# EasyEDA Pro project ProPrj_NFC1_2025-03-09.epro

# Board 电机驱动ASCII8833-3
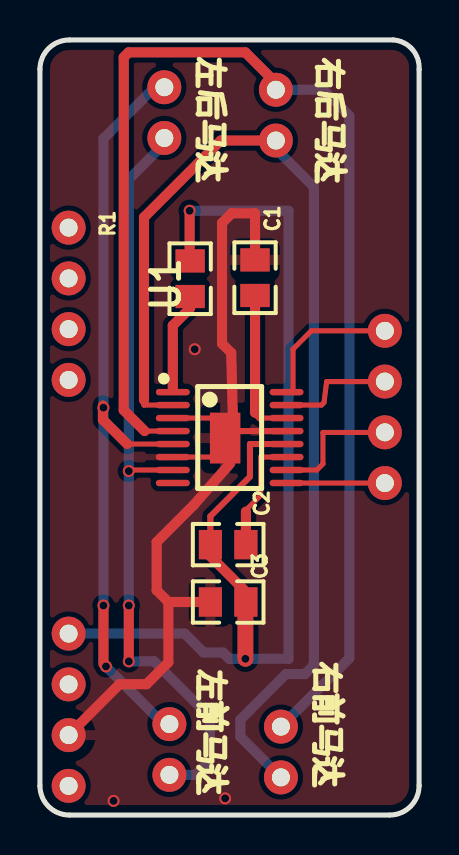
[diagram p0: board, top side]
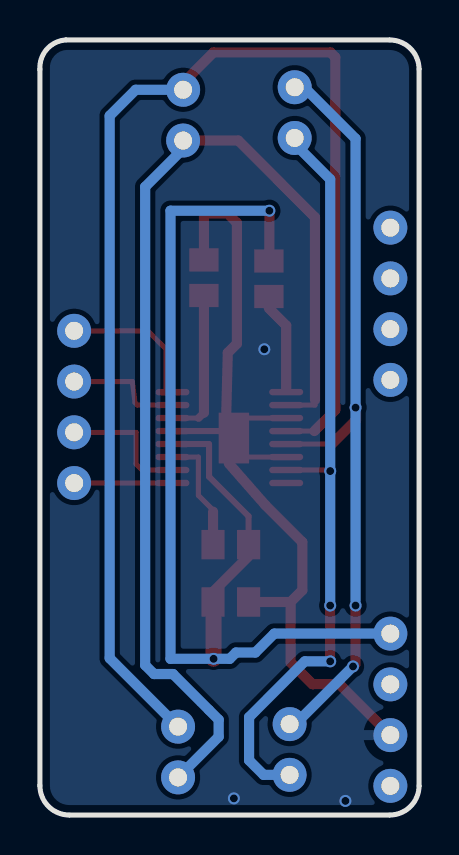
[diagram p1: board, bottom side, seen from below]

Outline 19 x 38.8 mm; copper layers: Top Layer, Bottom Layer. Coordinates in mm from the lower left corner of the outline.
Outline path: 0,37.32 arc(0.43,38.36) 1.47,38.8 ; 0,37.32 arc(0.43,38.36) 1.47,38.8 ; 0,37.32 0,1.47 ; 0,37.32 0,1.47 ; 1.47,38.8 17.7,38.8 ; 1.47,38.8 17.7,38.8 ; 0,1.47 arc(0.43,0.43) 1.47,0 ; 0,1.47 arc(0.43,0.43) 1.47,0 ; 17.7,38.8 arc(18.65,38.33) 19,37.32 ; 17.7,38.8 arc(18.65,38.33) 19,37.32 ; 1.47,0 17.53,0 ; 1.47,0 17.53,0 ; 17.53,0 arc(18.57,0.43) 19,1.47 ; 17.53,0 arc(18.57,0.43) 19,1.47 ; 19,37.32 19,1.47 ; 19,37.32 19,1.47
Stack: Top Layer 0.0356mm / Dielectric1 0.32mm FR-4 er 4.8 / Bottom Layer 0.0356mm

## Design rules (mm)
spacing Clearance (default): track to track 0.254, other pairs 0 to 0.254
track width Width (default): min 0.254, default 0.508, max 1.27
differential pair DiffPairsRouting (default): width min 0.381, default 0.381, max 0.381; gap min 0.254, default 0.254
via RoutingVias (default): diameter min 1.27, default 1.27, max 1.27; hole min 0.711, default 0.711, max 0.711

## Placement (name value [footprint] x y rotation side)
C1  2.2UF  [0805_R]  10.78 26.89 270 top
C2  10NF  [0805_R]  9.43 13.53 0 top
C3  10NF  [0805_R]  9.43 10.66 0 top
NOREF  -  [Pad_ie9]  6.23 33.89 270 top
NOREF#2  -  [Pad_ie10]  6.23 36.43 270 top
NOREF#3  -  [Pad_ie16]  1.44 4 270 top
NOREF#4  -  [Pad_ie7]  11.82 33.76 270 top
NOREF#5  -  [Pad_ie18]  1.44 9.08 270 top
NOREF#6  -  [Pad_ie189]  1.44 26.86 270 top
NOREF#7  -  [Pad_ie190]  1.44 29.4 270 top
NOREF#8  -  [Pad_ie17]  1.44 6.54 270 top
NOREF#9  -  [Pad_ie13]  17.28 19.16 270 top
NOREF#10  -  [Pad_ie14]  17.28 16.62 270 top
NOREF#11  -  [Pad_ie15]  1.44 1.46 270 top
NOREF#12  -  [Pad_ie4]  6.49 2.01 270 top
NOREF#13  -  [Pad_ie2]  1.44 24.32 270 top
NOREF#14  -  [Pad_ie5]  12.07 4.42 270 top
NOREF#15  -  [Pad_ie8]  11.82 36.3 270 top
NOREF#16  -  [Pad_ie11]  17.28 24.24 270 top
NOREF#17  -  [Pad_ie12]  17.28 21.7 270 top
NOREF#18  -  [Pad_ie3]  6.49 4.55 270 top
NOREF#19  -  [Pad_ie1]  1.44 21.78 270 top
NOREF#20  -  [Pad_ie21]  9.28 18.87 0 top
NOREF#21  -  [Pad_ie6]  12.07 1.88 270 top
R1  47K  [0805_R]  7.53 26.84 270 top
U1  DRV8833  [TSSOP-16]  9.51 18.89 270 top

## Footprints (pads in the part's own frame, mm; a bottom-side part is the same pattern mirrored in y, then rotated)
0805_R
  rect 1.16x1.47 smd: 1(-0.89,0) 2(0.89,0)
Pad_ie1
  round 1.7 hole 0.9: 0(0,0)
Pad_ie2
  round 1.7 hole 0.9: 0(0,0)
Pad_ie3
  round 1.7 hole 0.9: 0(0,0)
Pad_ie4
  round 1.7 hole 0.9: 0(0,0)
Pad_ie5
  round 1.7 hole 0.9: 0(0,0)
Pad_ie6
  round 1.7 hole 0.9: 0(0,0)
Pad_ie7
  round 1.7 hole 0.9: 0(0,0)
Pad_ie8
  round 1.7 hole 0.9: 0(0,0)
Pad_ie9
  round 1.7 hole 0.9: 0(0,0)
Pad_ie10
  round 1.7 hole 0.9: 0(0,0)
Pad_ie11
  round 1.7 hole 0.9: 0(0,0)
Pad_ie12
  round 1.7 hole 0.9: 0(0,0)
Pad_ie13
  round 1.7 hole 0.9: 0(0,0)
Pad_ie14
  round 1.7 hole 0.9: 0(0,0)
Pad_ie15
  round 1.7 hole 0.9: 0(0,0)
Pad_ie16
  round 1.7 hole 0.9: 0(0,0)
Pad_ie17
  round 1.7 hole 0.9: 0(0,0)
Pad_ie18
  round 1.7 hole 0.9: 0(0,0)
Pad_ie21
  rect 1.524x2.54 smd: 1(0,0)
Pad_ie189
  round 1.7 hole 0.9: 0(0,0)
Pad_ie190
  round 1.7 hole 0.9: 0(0,0)
TSSOP-16
  oval 0.32x1.7 smd: 1(-2.275,-2.85) 2(-1.625,-2.85) 3(-0.975,-2.85) 4(-0.325,-2.85) 5(0.325,-2.85) 6(0.975,-2.85) 7(1.625,-2.85) 8(2.275,-2.85) 9(2.275,2.85) 10(1.625,2.85) 11(0.975,2.85) 12(0.325,2.85) 13(-0.325,2.85) 14(-0.975,2.85) 15(-1.625,2.85) 16(-2.275,2.85)

## Nets
GND: C1.1 C3.1 NOREF#3.0 NOREF#20.1 U1.3 U1.6 U1.13
VCC: C2.1 C3.2 NOREF#5.0 R1.1 U1.12

Pads without a net: C1 2; C2 2; NOREF 0; NOREF#2 0; NOREF#4 0; NOREF#6 0; NOREF#7 0; NOREF#8 0; NOREF#9 0; NOREF#10 0; NOREF#11 0; NOREF#12 0; NOREF#13 0; NOREF#14 0; NOREF#15 0; NOREF#16 0; NOREF#17 0; NOREF#18 0; NOREF#19 0; NOREF#21 0; R1 2; U1 1 2 4 5 7 8 9 10 11 14 15 16

## Via types
v1: diameter 0.6, hole 0.4, Top Layer to Bottom Layer, 11 vias

## Routing (per net, layer and track width the routed paths; a pad name or vN(x,y) marks a point on that pad's centre or on a via; arc(x,y) is an arc through that point)
GND: length 40.9
  Top Layer w0.254: U1.3 8.77,19.87 ; U1.6 8.77,17.92
  Top Layer w0.305: 9.79,19.22 U1.13
  Top Layer w0.508: 6.43,10.66 C3.1 ; 6.43,10.66 5.85,11.25 5.85,13.66 7.7,15.52 9.53,17.6 ; 6.43,10.66 6.43,7.64 5.34,6.55 3.99,6.55 NOREF#3.0 ; 9.66,20.14 9.58,23.14 9.13,23.59 9.13,29.64 9.61,30.12 10.78,30.12 C1.1
  vias: v1(3.69,0.71) v1(7.75,23.31) v1(9.28,0.83)
VCC: length 53.4
  Top Layer w0.305: C2.1 8.54,14.96 10.52,16.94 10.52,18.57 11.69,18.57
  Top Layer w0.508: 8.54,12.95 10.32,11.17 ; 7.5,27.68 v1(7.5,30.25)
  Top Layer w0.8: v1(10.29,7.82) 10.29,10.23
  Bottom Layer w0.508: v1(7.5,30.25) 12.45,30.25 12.45,7.82 v1(10.29,7.82) 9.49,7.82 9.17,8.14 8.2,8.14 7.26,9.08 NOREF#5.0
(no net): length 242.8
  Top Layer w0.254: U1.15 14.11,20.52 14.23,20.65 14.37,21.7 NOREF#17.0 16.95,21.36 16.61,21.7 ; 5.21,20.77 5.21,20.52 U1.2 ; NOREF#16.0 13.6,24.24 12.68,23.32 12.68,21.13 ; 5.25,19.22 U1.4 ; 17.28,19.15 14.18,19.15 14.18,17.57 13.88,17.27 U1.10 ; 16.77,18.63 17.1,18.63 ; 4.45,17.27 U1.7 ; 4.37,18.57 U1.5 ; 11.05,19.87 U1.14 ; 7.53,25.37 R1.2 ; 12.64,16.62 NOREF#10.0 ; 10.4,15.34 11.06,16 11.06,17.92 U1.11
  Top Layer w0.381: 10.78,20.14 11.05,19.87
  Top Layer w0.508: 6.66,21.28 6.66,24.5 7.53,25.37 ; C2.2 10.32,15.19 ; 5.21,20.77 5.21,29.92 9.06,33.76 NOREF#4.0 ; 3.18,7.57 v1(3.18,10.49) ; 4.37,18.57 3.16,19.78 3.16,20.49 ; 11.82,36.27 NOREF#15.0 11.82,36.65 10.29,38.17 4.44,38.17 4.2,37.93 4.2,20.27 5.25,19.22 ; 10.78,20.14 C1.2 ; v1(4.45,7.69) v1(4.45,10.49)
  Bottom Layer w0.254: 17.39,16.46 17.43,16.46 17.6,16.45 17.76,16.43 17.93,16.4
  Bottom Layer w0.508: NOREF#15.0 14.2,36.3 15.5,35 15.5,7.85 NOREF#14.0 ; NOREF#2.0 5.76,36.43 3.18,33.85 3.18,10.74 ; v1(3.31,7.44) 6.2,4.55 NOREF#18.0 ; NOREF#21.0 10.04,3.92 10.04,4.77 12.33,7.06 13.28,7.06 13.72,7.5 13.72,31.44 11.82,33.34 NOREF#4.0 ; v1(4.45,10.49) 4.45,31.82 6.23,33.6 NOREF.0 ; NOREF#12.0 7.79,2.01 8.52,2.74 8.52,4.9 5.72,7.69 v1(4.45,7.69)
  vias: v1(3.18,20.39) v1(4.45,17.22)

## Copper pours and planes (outline as drawn; the poured copper is in the pictures)
GND on Top Layer: -1.14,39.82 19.95,39.82 19.95,-1.32 -1.14,-1.32
GND on Bottom Layer: -0.5,39.19 19.57,39.19 19.57,-0.94 -0.5,-0.94

## Text on the board
Top Silkscreen Layer: 左后马达 | 左前马达 | 右前马达 | 右后马达

# Board 麦克轮驱动
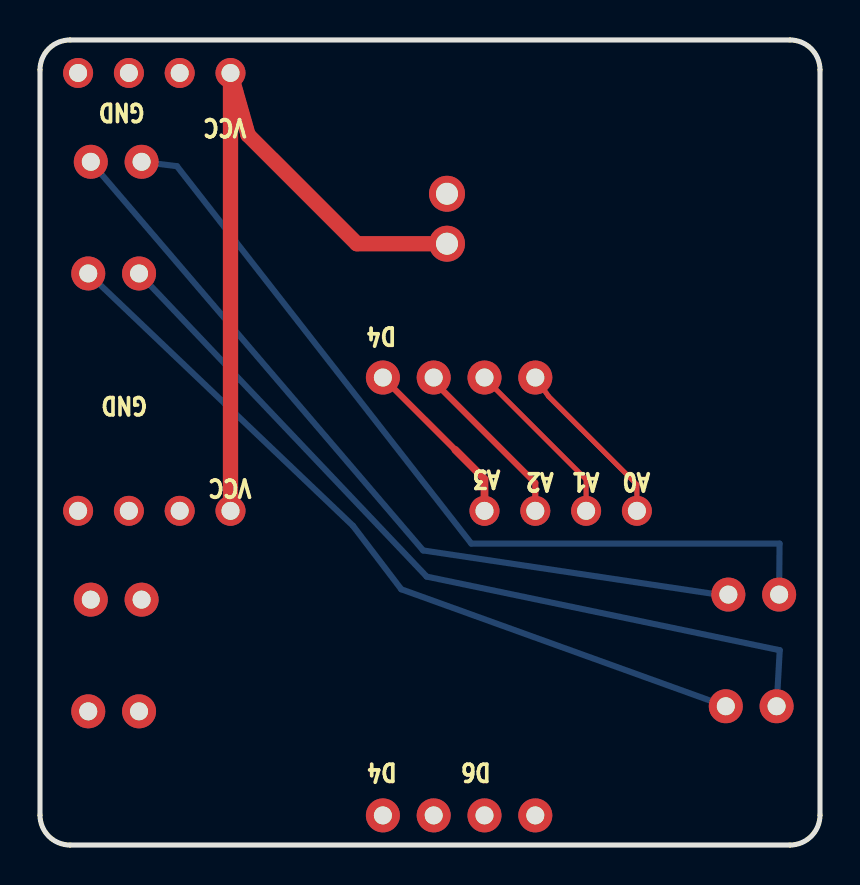
[diagram p2: board, top side]
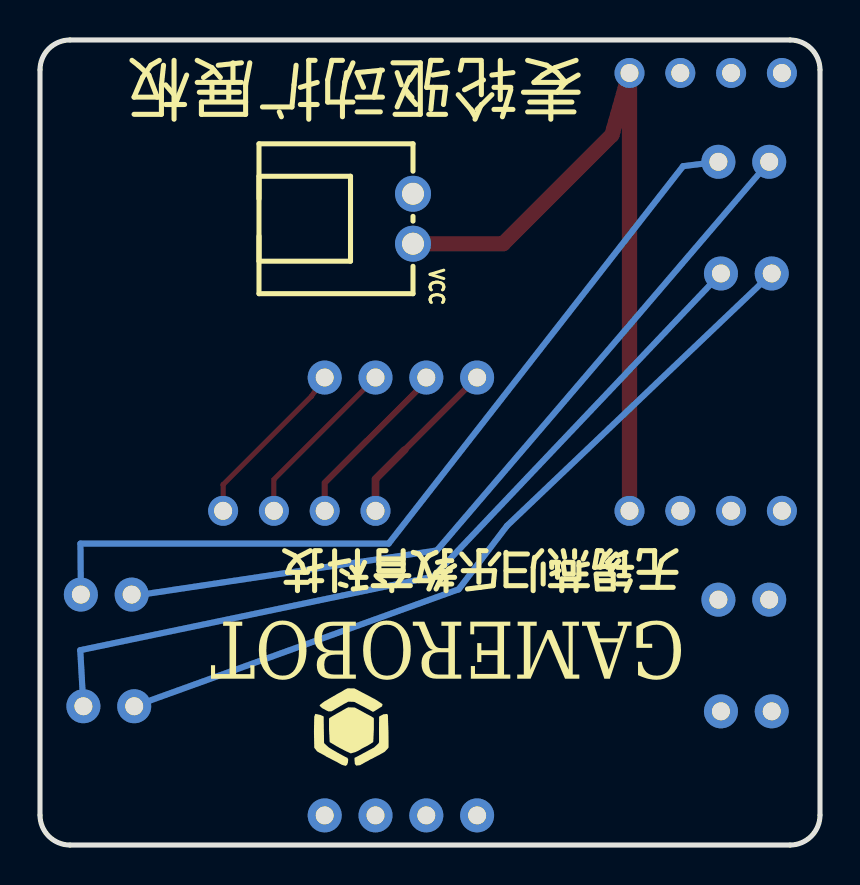
[diagram p3: board, bottom side, seen from below]

Outline 39 x 40.28 mm; copper layers: Top Layer, Bottom Layer. Coordinates in mm from the lower left corner of the outline.
Outline path: 0,38.78 0,1.5 arc(0.44,0.44) 1.5,0 37.5,0 arc(38.56,0.44) 39,1.5 39,38.78 arc(38.56,39.85) 37.5,40.28 1.5,40.28 arc(0.44,39.85) 0,38.78
Stack: Top Layer 0.035mm / Dielectric1 1.51mm FR4 er 4.5 / Bottom Layer 0.035mm

## Design rules (mm)
template: JLCPCB Capability(Two Layers Board)
spacing copperThickness1oz (default): track to track 0.102, other pairs 0.152 to 0.3
spacing copperThickness2oz: track to track 0.203, other pairs 0.152 to 0.3
track width copperThickness1oz (default): min 0.127, default 0.254, max 2.54
track width copperThickness2oz: min 0.203, default 0.254, max 2.54
differential pair differentialPair (default): width min 0.127, default 0.254, max 2.54; gap min 0.152, default 0.152
via viaSize (default): diameter min 0.5, default 0.61, max 10; hole min 0.3, default 0.305, max 6.3

## Placement (name value [footprint] x y rotation side)
NOREF  -  [Pad_ie10]  5.08 12.28 180 top
NOREF#2  -  [Pad_ie20]  4.95 28.6 180 top
NOREF#3  -  [Pad_e15]  24.77 16.72 0 top
NOREF#4  -  [Pad_ie17]  22.23 23.39 180 top
NOREF#5  -  [Pad_ie7]  17.15 1.48 180 top
NOREF#6  -  [Pad_ie4]  24.77 1.48 180 top
NOREF#7  -  [Pad_ie16]  24.77 23.39 180 top
NOREF#8  -  [Pad_ie9]  2.41 6.69 180 top
NOREF#9  -  [Pad_e360]  9.53 38.63 0 top
NOREF#10  -  [Pad_ie11]  2.54 12.28 180 top
NOREF#11  -  [Pad_ie21]  2.41 28.6 180 top
NOREF#12  -  [Pad_ie3]  34.29 6.94 180 top
NOREF#13  -  [Pad_e14]  22.23 16.72 0 top
NOREF#14  -  [Pad_e11]  9.53 16.72 0 top
NOREF#15  -  [Pad_ie0]  36.96 12.53 180 top
NOREF#16  -  [Pad_e16]  27.31 16.72 0 top
NOREF#17  -  [Pad_e357]  1.91 38.63 0 top
NOREF#18  -  [Pad_ie19]  17.15 23.39 180 top
NOREF#19  -  [Pad_ie2]  36.83 6.94 180 top
NOREF#20  -  [Pad_ie8]  4.95 6.69 180 top
NOREF#21  -  [Pad_e10]  6.99 16.72 0 top
NOREF#22  -  [Pad_e358]  4.45 38.63 0 top
NOREF#23  -  [Pad_e8]  1.91 16.72 0 top
NOREF#24  -  [Pad_e359]  6.99 38.63 0 top
NOREF#25  -  [Pad_ie18]  19.69 23.39 180 top
NOREF#26  -  [Pad_e9]  4.45 16.72 0 top
NOREF#27  -  [Pad_ie23]  2.54 34.19 180 top
NOREF#28  -  [Pad_ie22]  5.08 34.19 180 top
NOREF#29  -  [Pad_ie6]  19.69 1.48 180 top
NOREF#30  -  [Pad_e17]  29.84 16.72 0 top
NOREF#31  -  [Pad_ie1]  34.42 12.53 180 top
NOREF#32  -  [Pad_ie5]  22.23 1.48 180 top
VCC  HX25003-2WAP  [CONN-TH_2P-P2.50_HX25003-2WAP]  20.35 31.34 270 bottom

## Footprints (pads in the part's own frame, mm; a bottom-side part is the same pattern mirrored in y, then rotated)
CONN-TH_2P-P2.50_HX25003-2WAP
  round 1.8 hole 1.1: 1(-1.25,0) 2(1.25,0)
Pad_e8
  round 1.5 hole 0.9: 7(0,0)
Pad_e9
  round 1.5 hole 0.9: 8(0,0)
Pad_e10
  round 1.5 hole 0.9: 9(0,0)
Pad_e11
  round 1.5 hole 0.9: 10(0,0)
Pad_e14
  round 1.5 hole 0.9: 9(0,0)
Pad_e15
  round 1.5 hole 0.9: 9(0,0)
Pad_e16
  round 1.5 hole 0.9: 9(0,0)
Pad_e17
  round 1.5 hole 0.9: 9(0,0)
Pad_e357
  round 1.5 hole 0.9: 7(0,0)
Pad_e358
  round 1.5 hole 0.9: 8(0,0)
Pad_e359
  round 1.5 hole 0.9: 9(0,0)
Pad_e360
  round 1.5 hole 0.9: 10(0,0)
Pad_ie0
  round 1.7 hole 0.9: 0(0,0)
Pad_ie1
  round 1.7 hole 0.9: 0(0,0)
Pad_ie2
  round 1.7 hole 0.9: 0(0,0)
Pad_ie3
  round 1.7 hole 0.9: 0(0,0)
Pad_ie4
  round 1.7 hole 0.9: 0(0,0)
Pad_ie5
  round 1.7 hole 0.9: 0(0,0)
Pad_ie6
  round 1.7 hole 0.9: 0(0,0)
Pad_ie7
  round 1.7 hole 0.9: 0(0,0)
Pad_ie8
  round 1.7 hole 0.9: 0(0,0)
Pad_ie9
  round 1.7 hole 0.9: 0(0,0)
Pad_ie10
  round 1.7 hole 0.9: 0(0,0)
Pad_ie11
  round 1.7 hole 0.9: 0(0,0)
Pad_ie16
  round 1.7 hole 0.9: 0(0,0)
Pad_ie17
  round 1.7 hole 0.9: 0(0,0)
Pad_ie18
  round 1.7 hole 0.9: 0(0,0)
Pad_ie19
  round 1.7 hole 0.9: 0(0,0)
Pad_ie20
  round 1.7 hole 0.9: 0(0,0)
Pad_ie21
  round 1.7 hole 0.9: 0(0,0)
Pad_ie22
  round 1.7 hole 0.9: 0(0,0)
Pad_ie23
  round 1.7 hole 0.9: 0(0,0)

## Nets
GND: NOREF#22.8 NOREF#26.8 VCC.1
VCC: NOREF#9.10 NOREF#14.10 VCC.2
5: NOREF#5.0
6: NOREF#29.0
7: NOREF#32.0
8: NOREF#6.0
A0: NOREF#7.0 NOREF#30.9
A1: NOREF#4.0 NOREF#16.9
A2: NOREF#3.9 NOREF#25.0
A3: NOREF#13.9 NOREF#18.0

Pads without a net: NOREF 0; NOREF#2 0; NOREF#8 0; NOREF#10 0; NOREF#11 0; NOREF#12 0; NOREF#15 0; NOREF#17 7; NOREF#19 0; NOREF#20 0; NOREF#21 9; NOREF#23 7; NOREF#24 9; NOREF#27 0; NOREF#28 0; NOREF#31 0

## Routing (per net, layer and track width the routed paths; a pad name or vN(x,y) marks a point on that pad's centre or on a via; arc(x,y) is an arc through that point)
VCC: length 37.3
  Top Layer w0.762: VCC.2 15.84,30.09 10.41,35.53 NOREF#9.10 NOREF#14.10
(no net): length 166
  Bottom Layer w0.305: NOREF#28.0 6.85,33.97 21.57,15.08 36.98,15.08 NOREF#15.0 ; NOREF#11.0 15.65,15.97 18.06,12.8 NOREF#12.0 ; NOREF#19.0 36.99,9.75 19.33,13.43 NOREF#2.0 ; NOREF#27.0 19.16,14.74 34.33,12.47 NOREF#31.0
A0: length 8.7
  Top Layer w0.254: NOREF#7.0 25.43,22.45 29.84,18.03 NOREF#30.9
A1: length 8.8
  Top Layer w0.254: NOREF#4.0 22.23,23.37 27.31,18.29 NOREF#16.9
A2: length 8.8
  Top Layer w0.305: NOREF#3.9 24.77,18.12 19.69,23.2 NOREF#25.0
A3: length 8.8
  Top Layer w0.305: 20.77,19.77 NOREF#18.0
  Top Layer w0.381: 20.77,19.77 22.23,18.31 NOREF#13.9

## Copper pours and planes (outline as drawn; the poured copper is in the pictures)
GND on Top Layer: -0.73,40.99 40.04,40.99 40.04,-0.79 -0.73,-0.79
GND on Bottom Layer: -0.86,41.5 39.65,41.5 39.65,-0.54 -0.86,-0.54

## Text on the board
Bottom Silkscreen Layer: 无锡燕归乐教育科技 | 麦轮驱动扩展板 | GAMEROBOT
Top Silkscreen Layer: GND | VCC | D4 | D6 | A3 | A2 | A1 | A0

# Board NFC1扩展板
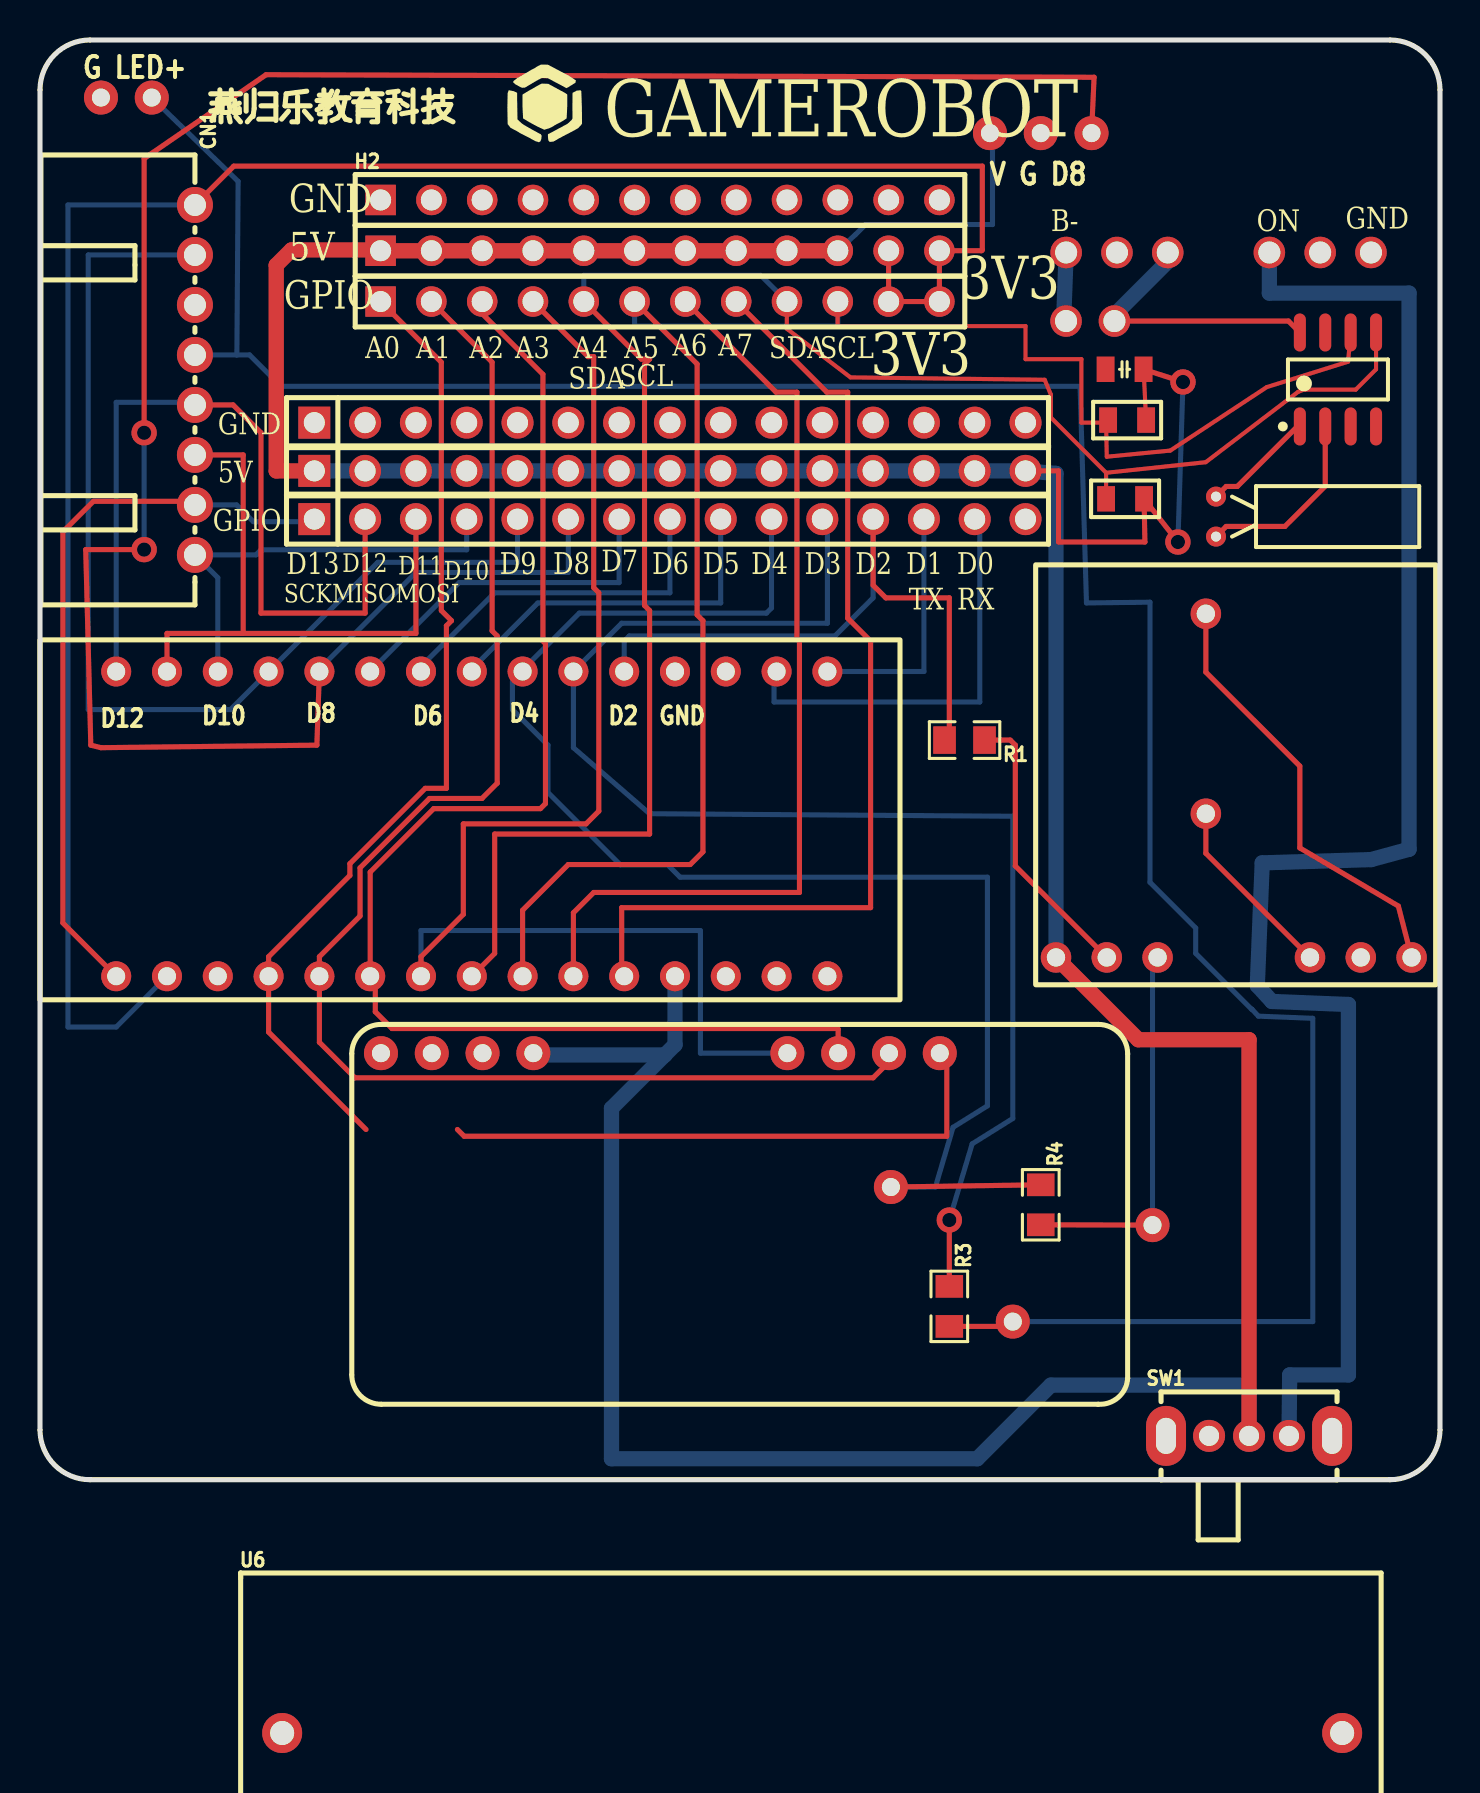
[diagram p4: board, top side]
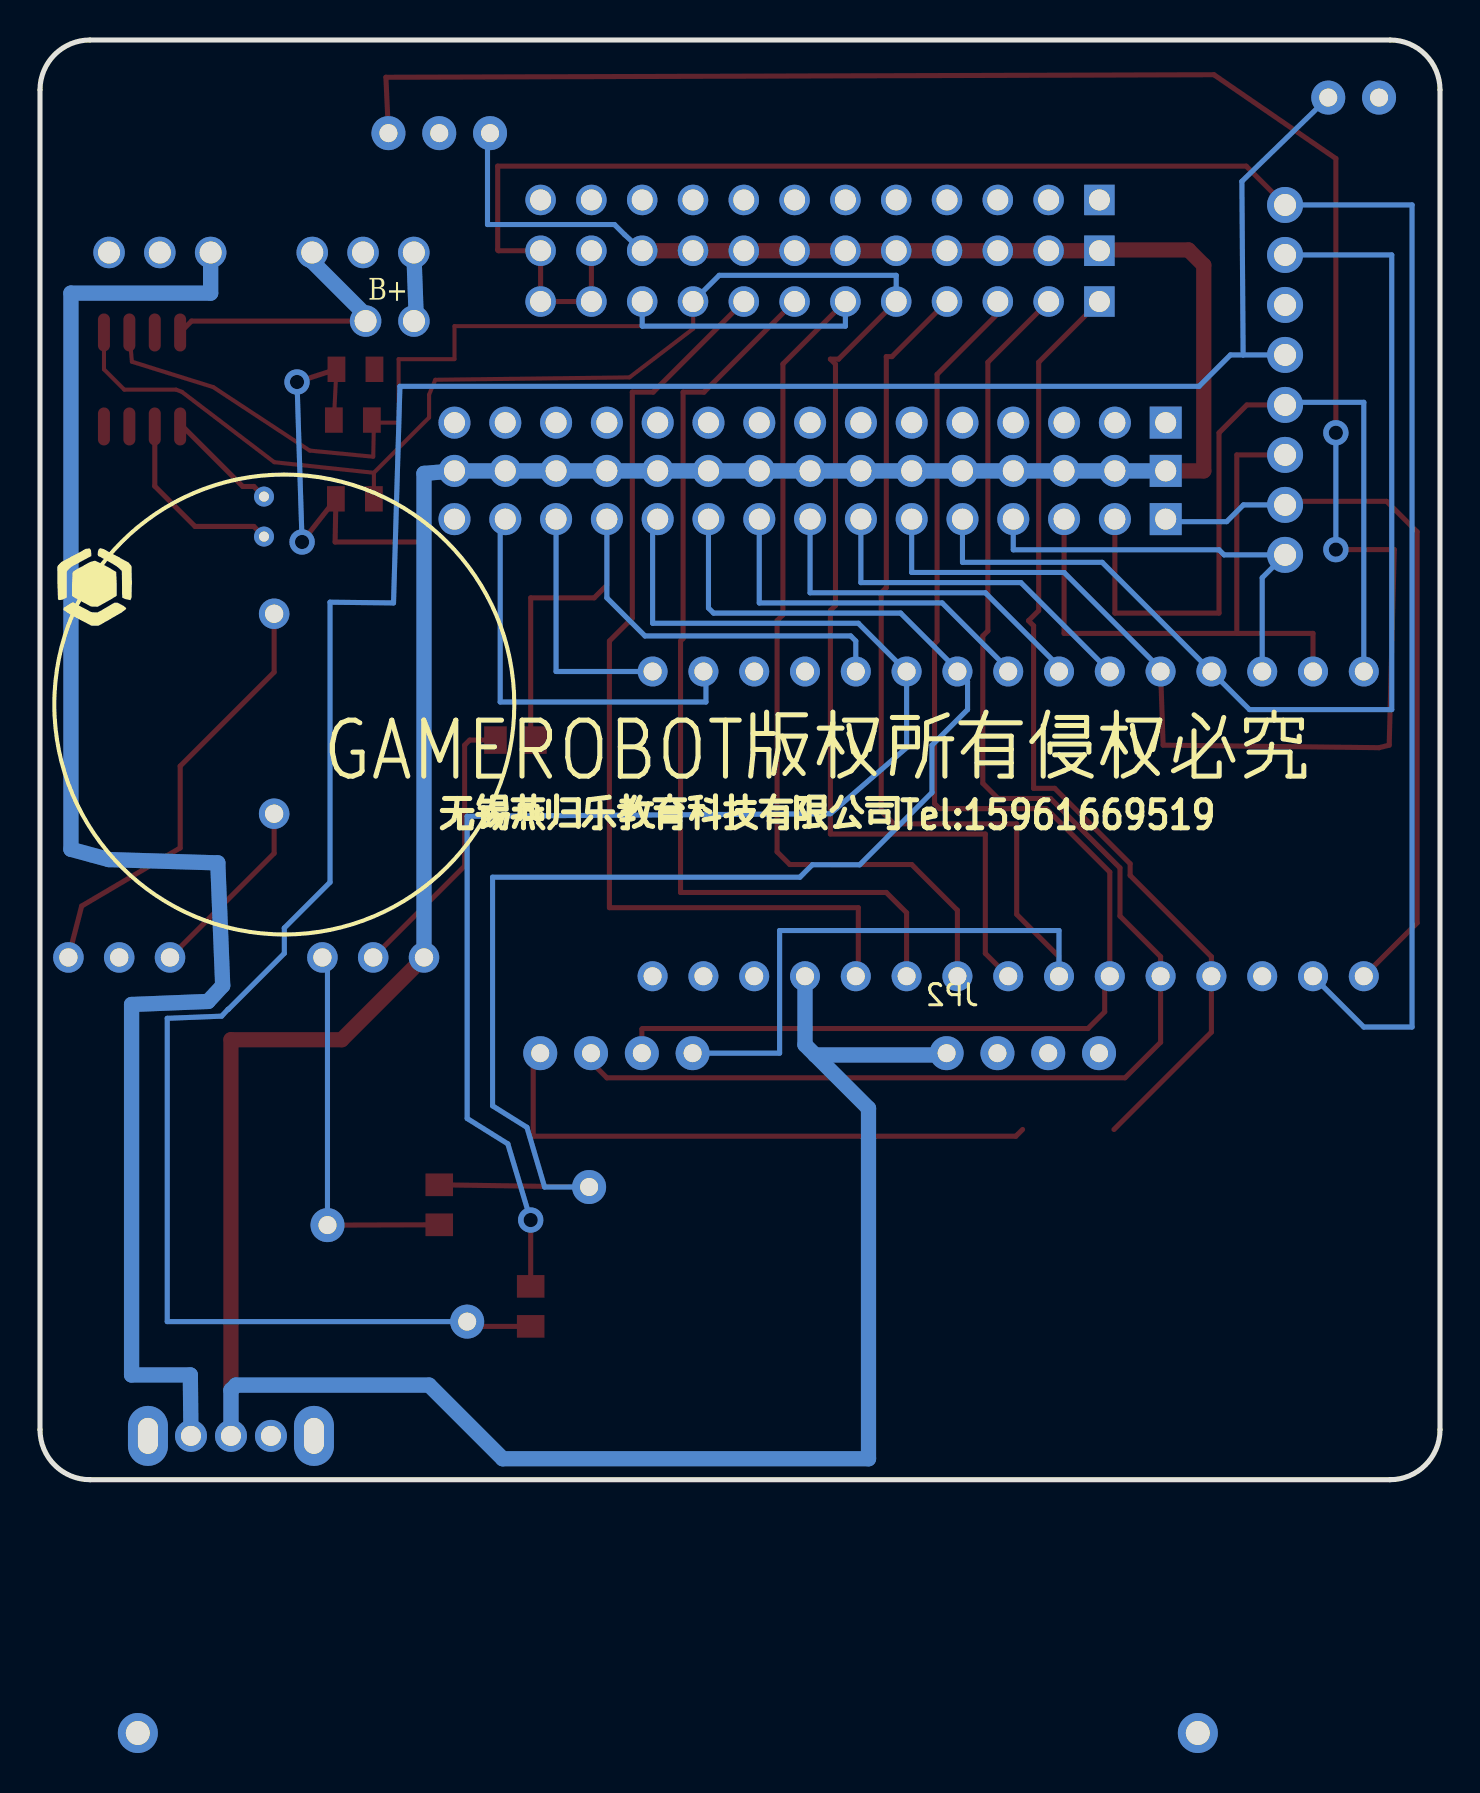
[diagram p5: board, bottom side, seen from below]

Outline 70 x 72 mm; copper layers: Top Layer, Bottom Layer. Coordinates in mm from the lower left corner of the outline.
Outline path: 0,69.5 0,2.5 arc(0.73,0.73) 2.5,0 67.5,0 arc(69.27,0.73) 70,2.5 70,69.5 arc(69.27,71.27) 67.5,72 2.5,72 arc(0.73,71.27) 0,69.5
Stack: Top Layer 0.0356mm / Dielectric1 0.32mm FR-4 er 4.8 / Bottom Layer 0.0356mm

## Design rules (mm)
template: 用户自定义配置
spacing Clearance (default): track to track 0.254, other pairs 0 to 0.254
track width Width (default): min 0.203, default 0.254, max 0.762
differential pair DiffPairsRouting (default): width min 0.381, default 0.381, max 0.381; gap min 0.254, default 0.254
via RoutingVias (default): diameter min 1.27, default 1.27, max 1.27; hole min 0.711, default 0.711, max 0.711

## Placement (name value [footprint] x y rotation side)
C20  104  [C 0805_L]  54.23 55.53 180 top
CN1  HX25003-8WAP  [CONN-TH_8P-P2.50_HX25003-8WAP]  7.75 55 270 top
H2  -  [HDR-TH_15P-P2.54-V-M]  31.5 52.86 0 top
H2#2  -  [HDR-TH_15P-P2.54-V-M]  31.5 50.45 0 top
H2#3  -  [HDR-TH_15P-P2.54-V-M]  31.5 48.04 0 top
H2#4  -  [HDR-TH_12P-P2.54-V-M]  31 64 0 top
H3  -  [HDR-TH_12P-P2.54-V-M]  31 61.46 0 top
H4  -  [HDR-TH_12P-P2.54-V-M]  31 58.92 0 top
JP2  Header-Male-2.54_1x15  [hdr-th_15p-p2.54-v-a]  21.59 25.18 180 top
JP3  Header-Male-2.54_1x15  [hdr-th_15p-p2.54-v-a]  21.59 40.42 180 top
NOREF  -  [Pad_e1]  47.5 67.34 0 top
NOREF#2  -  [Pad_e81]  53.72 57.94 0 top
NOREF#3  -  [Pad_ie25]  66.04 26.12 0 top
NOREF#4  -  [Pad_e804]  64.01 61.37 0 top
NOREF#5  -  [Pad_ie46]  24.67 21.33 180 top
NOREF#6  -  [Pad_e82]  51.3 57.94 0 top
NOREF#7  -  [Pad_ie15]  53.34 26.12 0 top
NOREF#8  -  [Pad_e12]  52.58 67.34 0 top
NOREF#9  -  [Pad_e811]  53.85 61.37 0 top
NOREF#10  -  [Pad_e6]  42.45 21.33 0 top
NOREF#11  -  [Pad_e423]  5.59 69.12 180 top
NOREF#12  -  [Pad_ie45]  42.54 14.64 180 top
NOREF#13  -  [Pad_e76]  51.31 61.37 0 top
NOREF#14  -  [Pad_ie47]  22.13 21.33 180 top
NOREF#15  -  [Pad_ie20]  63.5 26.12 0 top
NOREF#16  -  [Pad_e749]  48.64 7.91 180 top
NOREF#17  -  [Pad_e230]  58.29 43.31 270 top
NOREF#18  -  [Pad_ie12]  50.8 26.12 0 top
NOREF#19  -  [Pad_e67]  66.55 61.37 0 top
NOREF#20  -  [Pad_ie48]  19.59 21.33 180 top
NOREF#21  -  [Pad_ie16]  55.88 26.12 0 top
NOREF#22  -  [Pad_ie26]  68.58 26.12 0 top
NOREF#23  -  [Pad_e9]  50.04 67.34 0 top
NOREF#24  -  [Pad_e232]  58.29 33.31 270 top
NOREF#25  -  [Pad_e8]  37.37 21.33 0 top
NOREF#26  -  [Pad_e5]  44.99 21.33 0 top
NOREF#27  -  [Pad_e73]  61.47 61.37 0 top
NOREF#28  -  [Pad_e23]  55.63 12.73 0 top
NOREF#29  -  [Pad_ie49]  17.05 21.33 180 top
NOREF#30  -  [Pad_e425]  3.05 69.12 180 top
NOREF#31  -  [Pad_e75]  56.39 61.37 0 top
NOREF#32  -  [Pad_e7]  39.91 21.33 0 top
R1  10K  [R0805]  46.23 36.99 180 top
R3  1K  [R0805]  45.47 8.67 270 top
R4  1K  [R0805]  50.04 13.75 270 top
R16  10K  [R 0805_L]  54.36 52.99 0 top
R17  10K  [R 0805_L]  54.25 49.05 0 top
SW1  -  [拨动开关_侧]  60.45 2.19 0 top
U5  DS1307Z+T&R  [S8+2_L]  64.9 55.02 90 top
U6  1节5号电池座带焊针  [BAT-TH_L57.0-W16.0-P53.00]  38.61 -12.67 0 top
Y3  32.768kHz  [OSC-3x8-WI-A]  58.8 48.17 270 top

## Footprints (pads in the part's own frame, mm; a bottom-side part is the same pattern mirrored in y, then rotated)
BAT-TH_L57.0-W16.0-P53.00
  round 2 hole 1.2: 1(-26.5,0) 2(26.5,0)
C 0805_L
  rect 0.889x1.27 smd: 1(-0.95,0) 2(0.95,0)
CONN-TH_8P-P2.50_HX25003-8WAP
  round 1.8 hole 1.1: 1(-8.75,0) 2(-6.25,0) 3(-3.75,0) 4(-1.25,0) 5(1.25,0) 6(3.75,0) 7(6.25,0) 8(8.75,0)
HDR-TH_12P-P2.54-V-M
  rect 1.524x1.524 hole 1.05: 1(-13.97,0)
  round 1.524 hole 1.05: 2(-11.43,0) 3(-8.89,0) 4(-6.35,0) 5(-3.81,0) 6(-1.27,0) 7(1.27,0) 8(3.81,0) 9(6.35,0) 10(8.89,0) 11(11.43,0) 12(13.97,0)
hdr-th_15p-p2.54-v-a
  round 1.5 hole 0.9: 1(-17.78,0) 2(-15.24,0) 3(-12.7,0) 4(-10.16,0) 5(-7.62,0) 6(-5.08,0) 7(-2.54,0) 8(0,0) 9(2.54,0) 10(5.08,0) 11(7.62,0) 12(10.16,0) 13(12.7,0) 14(15.24,0) 15(17.78,0)
HDR-TH_15P-P2.54-V-M
  rect 1.6x1.6 hole 1.05: 1(-17.78,0)
  round 1.6 hole 1.05: 2(-15.24,0) 3(-12.7,0) 4(-10.16,0) 5(-7.62,0) 6(-5.08,0) 7(-2.54,0) 8(0,0) 9(2.54,0) 10(5.08,0) 11(7.62,0) 12(10.16,0) 13(12.7,0) 14(15.24,0) 15(17.78,0)
OSC-3x8-WI-A
  round 1 hole 0.5: 1(1,0) 2(-1,0)
Pad_e1
  round 1.7 hole 0.9: 21(0,0)
Pad_e5
  round 1.7 hole 0.9: 1(0,0)
Pad_e6
  round 1.7 hole 0.9: 2(0,0)
Pad_e7
  round 1.7 hole 0.9: 3(0,0)
Pad_e8
  round 1.7 hole 0.9: 4(0,0)
Pad_e9
  round 1.7 hole 0.9: 22(0,0)
Pad_e12
  round 1.7 hole 0.9: 23(0,0)
Pad_e23
  round 1.7 hole 0.9: 10(0,0)
Pad_e67
  round 1.575 hole 1.1: 1(0,0)
Pad_e73
  round 1.575 hole 1.1: 3(0,0)
Pad_e75
  round 1.575 hole 1.1: 3(0,0)
Pad_e76
  round 1.575 hole 1.1: 3(0,0)
Pad_e81
  round 1.575 hole 1.1: 3(0,0)
Pad_e82
  round 1.575 hole 1.1: 3(0,0)
Pad_e230
  round 1.524 hole 0.914: 2(0,0)
Pad_e232
  round 1.524 hole 0.914: 1(0,0)
Pad_e423
  round 1.7 hole 0.9: 21(0,0)
Pad_e425
  round 1.7 hole 0.9: 21(0,0)
Pad_e749
  round 1.7 hole 0.9: 1(0,0)
Pad_e804
  round 1.575 hole 1.1: 3(0,0)
Pad_e811
  round 1.575 hole 1.1: 3(0,0)
Pad_ie12
  round 1.524 hole 0.914: 12(0,0)
Pad_ie15
  round 1.524 hole 0.914: 12(0,0)
Pad_ie16
  round 1.524 hole 0.914: 12(0,0)
Pad_ie20
  round 1.524 hole 0.914: 12(0,0)
Pad_ie25
  round 1.524 hole 0.914: 11(0,0)
Pad_ie26
  round 1.524 hole 0.914: 11(0,0)
Pad_ie45
  round 1.7 hole 0.9: 0(0,0)
Pad_ie46
  round 1.7 hole 0.9: 0(0,0)
Pad_ie47
  round 1.7 hole 0.9: 0(0,0)
Pad_ie48
  round 1.7 hole 0.9: 0(0,0)
Pad_ie49
  round 1.7 hole 0.9: 0(0,0)
R0805
  rect 1.133x1.377 smd: 1(-1,0) 2(1,0)
R 0805_L
  rect 0.889x1.27 smd: 1(-0.95,0) 2(0.95,0)
S8+2_L
  oval 1.9x0.6 smd: 1(-2.35,1.905) 2(-2.35,0.635) 3(-2.35,-0.635) 4(-2.35,-1.905) 5(2.35,-1.905) 6(2.35,-0.635) 7(2.35,0.635) 8(2.35,1.905)
拨动开关_侧
  oval 1.6x1.6 hole 1.001: 1(-1.999,0) 2(0,0) 3(1.999,0)
  oval 1.999x2.999 hole 1.001x1.801: 4(4.151,0) 5(-4.151,0)

## Nets
3V3: CN1.1 H3.11 H3.12 H4.11 H4.12 JP2.14
GND: C20.2 CN1.3 H2.1 H2.2 H2.3 H2.4 H2.5 H2.6 H2.7 H2.8 H2.9 H2.10 H2.11 H2.12 H2.13 H2.14 H2.15 H2#4.1 H2#4.2 H2#4.3 H2#4.4 H2#4.5 H2#4.6 H2#4.7 H2#4.8 H2#4.9 H2#4.10 H2#4.11 H2#4.12 JP2.2 JP3.4 NOREF#3.11 NOREF#19.1 NOREF#20.0 NOREF#23.22 NOREF#30.21 U5.4
VCC: C20.1 H2#2.1 H2#2.2 H2#2.3 H2#2.4 H2#2.5 H2#2.6 H2#2.7 H2#2.8 H2#2.9 H2#2.10 H2#2.11 H2#2.12 H2#2.13 H2#2.14 H2#2.15 H3.1 H3.2 H3.3 H3.4 H3.5 H3.6 H3.7 H3.8 H3.9 H3.10 JP2.4 NOREF.21 NOREF#5.0 NOREF#18.12 R16.2 R17.2 SW1.2
VIN: JP2.1
A0: H4.1 JP2.12 NOREF#26.1
A1: H4.2 JP2.11 NOREF#10.2
A2: H4.3 JP2.10 NOREF#32.3
A3: H4.4 JP2.9 NOREF#25.4
A4/SDA: H4.5 H4.9 JP2.8 R17.1 U5.5
A5/SCL: H4.6 H4.10 JP2.7 R16.1 U5.6
A6: H4.7 JP2.6
A7: H4.8 JP2.5
AREF: JP2.13
B+: NOREF#2.3 NOREF#31.3 U5.8
B-: NOREF#6.3 NOREF#13.3
D0/RX: H2#3.14 JP3.2
D1/TX: H2#3.13 JP3.1
D1_2: U5.3
D2: H2#3.12 JP3.5 R1.2
D3: H2#3.11 JP3.6 R3.1
D4: H2#3.10 JP3.7 NOREF#12.0 R4.1
D5: H2#3.9 JP3.8
D6: H2#3.8 JP3.9
D7: H2#3.7 JP3.10
D8: H2#3.6 JP3.11 NOREF#8.23
D9: CN1.2 H2#3.5 JP3.12
D10/SS: CN1.8 H2#3.4 JP3.13
D11/MOSI: CN1.6 H2#3.3 JP3.14
D12/MISO: CN1.5 H2#3.2 JP3.15
D13/SCK: CN1.7 H2#3.1 JP2.15
LED+: CN1.4 NOREF#11.21 NOREF#16.1 R3.2
ON: NOREF#27.3 SW1.3
RX1: NOREF#7.12 R1.1
SPK1: NOREF#15.12 NOREF#24.1
SPK2: NOREF#17.2 NOREF#22.11
TX2: NOREF#21.12 NOREF#28.10 R4.2
Y1: U5.1 Y3.2
Y2: U5.2 Y3.1

Pads without a net: H2#3 15; JP2 3; JP3 3; NOREF#4 3; NOREF#9 3; NOREF#14 0; NOREF#29 0; SW1 1 4 5; U5 7; U6 1 2

## Via types
v1: diameter 1.27, hole 0.711, Top Layer to Bottom Layer, 5 vias

## Routing (per net, layer and track width the routed paths; a pad name or vN(x,y) marks a point on that pad's centre or on a via; arc(x,y) is an arc through that point)
3V3: length 107.6
  Top Layer w0.254: H3.11 H4.11 H4.12 H3.12 47.08,61.46 47.12,61.5 47.12,65.69 9.69,65.69 CN1.1
  Bottom Layer w0.254: CN1.1 1.4,63.75 1.4,22.64 3.81,22.64 JP2.14
VCC: length 240.8
  Top Layer w0.203: C20.1 R16.2
  Top Layer w0.254: H2#2.15 50.93,50.45 50.93,46.89 55.25,46.89 R17.2 v1(56.9,46.89) ; C20.1 v1(57.15,54.9)
  Top Layer w0.762: H3.10 H3.9 H3.8 H3.7 H3.6 H3.5 H3.4 H3.3 H3.2 H3.1 16.99,61.5 12.57,61.5 11.81,60.74 11.81,50.45 H2#2.1 ; SW1.2 60.45,22 54.91,22 NOREF#18.12
  Bottom Layer w0.254: v1(57.15,54.9) v1(56.9,46.89) ; NOREF.21 47.62,67.22 47.62,62.77 41.28,62.77 40.77,62.26 H3.10
  Bottom Layer w0.762: SW1.2 60.45,4.48 60.2,4.73 50.55,4.73 46.86,1.05 28.57,1.05 28.57,18.57 31.24,21.24 ; H2#2.1 H2#2.2 H2#2.3 H2#2.4 H2#2.5 H2#2.6 H2#2.7 H2#2.8 H2#2.9 H2#2.10 H2#2.11 H2#2.12 H2#2.13 H2#2.14 H2#2.15 50.8,50.32 NOREF#18.12 ; 31.24,21.24 24.76,21.24 NOREF#5.0 ; 31.24,21.24 31.75,21.75 JP2.4
A0: length 78.2
  Top Layer w0.254: H4.1 20.07,55.88 20.07,43.47 20.57,42.96 20.32,42.7 20.32,34.58 19.26,34.58 15.49,30.81 15.49,30.22 11.43,26.16 JP2.12 11.43,22.38 16.3,17.51 ; NOREF#26.1 45.34,20.98 45.34,17.18 21.21,17.18 20.87,17.51
A1: length 73.6
  Top Layer w0.254: NOREF#10.2 42.45,20.89 41.66,20.1 15.75,20.1 13.97,21.88 JP2.11 13.97,26.16 16,28.19 16,30.6 19.47,34.07 22.1,34.07 22.86,34.83 22.86,42.2 22.61,42.45 22.61,55.88 H4.2
A2: length 68.4
  Top Layer w0.254: H4.3 22.11,58.31 25.15,55.28 25.15,41.94 25.27,41.81 25.27,33.81 25.02,33.56 19.69,33.56 16.51,30.39 JP2.10 16.76,24.92 16.76,23.4 17.6,22.56 39.88,22.56 39.91,22.53 NOREF#32.3
A3: length 69.3
  Top Layer w0.254: JP2.9 19.05,26.16 21.17,28.27 21.17,32.8 27.31,32.8 27.94,33.43 27.94,44.36 27.69,44.61 27.69,56.17 27.4,56.17 H4.4
  Bottom Layer w0.254: NOREF#25.4 33.02,21.33 33.02,27.46 19.05,27.46 JP2.9
A4/SDA: length 95
  Top Layer w0.203: 53.3,50.36 53.3,50.35 R17.1 ; 53.3,50.36 53.3,50.36 50.55,53.12 50.55,54.26 50.23,55.01 40.52,55.13 37.34,57.56 H4.9 ; 53.3,50.36 58.29,50.89 62.9,54.4 63.2,54.52 65.79,54.52 66.8,55.53 U5.5
  Top Layer w0.254: H4.5 30.07,56.04 30.48,56.04 30.23,55.78 30.23,43.72 30.48,43.47 30.48,32.29 22.73,32.29 22.73,26.32 JP2.8
  Bottom Layer w0.254: H4.5 27.19,60.23 36.04,60.23 H4.9
A5/SCL: length 91
  Top Layer w0.203: U5.6 65.41,55.91 61.34,54.64 56.51,51.47 53.34,51.16 53.3,52.86 52.07,52.86 52.07,56.04 49.28,56.04 49.28,57.69 39.88,57.69 H4.10
  Top Layer w0.254: H4.6 32.85,55.8 32.85,43.25 33.15,42.96 33.15,31.4 32.51,30.77 26.42,30.77 24.13,28.48 JP2.7
  Bottom Layer w0.254: H4.10 39.89,57.7 39.88,57.69 29.73,57.69 H4.6
A6: length 47.4
  Top Layer w0.254: H4.7 36.8,54.39 37.85,54.39 37.85,42.07 37.97,41.94 37.97,29.37 27.69,29.37 26.67,28.35 JP2.6
A7: length 49.6
  Top Layer w0.254: JP2.5 29.08,25.31 29.08,28.61 41.53,28.61 41.53,41.94 40.39,43.08 40.39,54.39 39.34,54.39 H4.8
B+: length 14
  Top Layer w0.254: NOREF#2.3 62.42,57.94 U5.8
  Bottom Layer w0.762: NOREF#31.3 56.39,60.92 53.72,58.25 NOREF#2.3
B-: length 3.4
  Bottom Layer w0.762: NOREF#13.3 51.18,57.94
D0/RX: length 21.3
  Bottom Layer w0.254: H2#3.14 46.99,48.04 46.99,38.89 36.7,38.89 36.7,40.42 JP3.2
D1/TX: length 12.4
  Bottom Layer w0.254: JP3.1 44.2,40.42 H2#3.13
D2: length 33.5
  Top Layer w0.254: 44.97,36.99 45.47,37.48 45.47,44.1 42.29,44.1 41.66,44.74 H2#3.12
  Bottom Layer w0.254: JP3.5 29.21,41.94 29.46,42.2 39.75,42.2 41.66,44.1 H2#3.12
D3: length 70.8
  Top Layer w0.254: v1(45.47,12.99) R3.1
  Bottom Layer w0.254: H2#3.11 39.37,47.78 39.37,42.83 29.08,42.83 JP3.6 26.67,36.61 30.48,33.31 48.64,33.18 48.64,18.07 46.61,16.8 v1(45.47,12.99)
D4: length 75.3
  Top Layer w0.254: NOREF#12.0 R4.1
  Bottom Layer w0.254: H2#3.10 36.58,43.59 36.32,43.34 26.97,43.34 24.13,40.5 JP3.7 23.62,39.91 23.62,38.51 25.4,36.73 25.4,34.37 29.01,30.75 31.38,30.75 32,30.13 47.37,30.13 47.37,18.7 45.65,17.62 44.77,14.64 NOREF#12.0
D5: length 18.1
  Bottom Layer w0.254: H2#3.9 34.04,43.85 24.89,43.85 21.59,40.55 JP3.8
D6: length 17.9
  Bottom Layer w0.254: JP3.9 19.05,40.67 22.73,44.36 31.5,44.36 H2#3.8
D7: length 17.5
  Bottom Layer w0.254: JP3.10 20.96,44.86 28.96,44.86 H2#3.7
D8: length 116.1
  Top Layer w0.254: v1(5.21,46.51) 2.29,46.51 2.54,36.73 3.05,36.61 13.84,36.73 JP3.11 ; v1(5.21,52.36) 5.21,66.07 11.3,70.26 52.71,70.14 NOREF#8.23
  Bottom Layer w0.254: H2#3.6 26.42,45.37 18.8,45.37 13.97,40.55 JP3.11 ; v1(5.21,52.36) v1(5.21,46.51)
D9: length 54.7
  Bottom Layer w0.254: CN1.2 2.41,61.25 2.41,38.51 9.53,38.51 JP3.12 16.89,45.88 23.88,45.88 H2#3.5
D10/SS: length 21.5
  Bottom Layer w0.254: H2#3.4 21.34,46.5 11.05,46.5 10.8,46.25 CN1.8 8.89,45.11 JP3.13
D11/MOSI: length 31.4
  Top Layer w0.254: 10.1,42.32 6.35,42.32 JP3.14 ; 10.1,42.32 18.8,42.32 H2#3.3 ; 10.1,42.32 10.16,42.38 10.16,51.25 CN1.6
D12/MISO: length 40.3
  Top Layer w0.254: H2#3.2 16.26,43.34 11.05,43.34 11.05,52.36 9.66,53.75 CN1.5
  Bottom Layer w0.254: JP3.15 3.81,53.88 7.62,53.88 CN1.5
D13/SCK: length 37
  Top Layer w0.254: CN1.7 7.57,48.93 2.67,48.93 1.14,47.4 1.14,27.84 JP2.15
  Bottom Layer w0.254: CN1.7 9.83,48.75 10.67,47.91 13.59,47.91 H2#3.1
LED+: length 132.7
  Top Layer w0.254: R3.2 48.4,7.67 NOREF#16.1
  Bottom Layer w0.254: 9.84,56.25 9.91,64.93 NOREF#11.21 ; 9.84,56.25 10.48,56.25 12.05,54.68 52,54.68 52.32,43.85 55.5,43.88 55.5,29.88 57.78,27.59 57.78,26.32 60.58,23.53 60.6,23.53 60.92,23.18 63.64,23.07 63.64,7.91 NOREF#16.1 ; 9.84,56.25 CN1.4
ON: length 79.8
  Bottom Layer w0.762: NOREF#27.3 61.47,59.34 68.45,59.34 68.45,31.53 66.56,31.01 61.11,30.85 60.87,24.71 61.6,23.92 65.42,23.77 65.42,5.24 62.48,5.24 SW1.3
RX1: length 14.4
  Top Layer w0.254: NOREF#7.12 48.77,30.69 48.77,36.73 48.51,36.99 46.97,36.99
SPK1: length 9.3
  Top Layer w0.254: NOREF#15.12 58.29,31.33 NOREF#24.1
SPK2: length 22
  Top Layer w0.254: NOREF#22.11 67.92,28.69 62.99,31.59 62.99,35.69 58.29,40.39 NOREF#17.2
TX2: length 19.1
  Top Layer w0.254: R4.2 NOREF#28.10
  Bottom Layer w0.254: NOREF#28.10 55.63,25.86 NOREF#21.12
Y1: length 5.7
  Top Layer w0.254: Y3.2 59.31,49.67 59.87,49.67 62.99,52.8
Y2: length 9.6
  Top Layer w0.254: Y3.1 59.31,47.67 62.25,47.67 64.26,49.69 64.26,52.8

## Text on the board
Bottom Silkscreen Layer: 无锡燕归乐教育科技有限公司Tel:15961669519 | GAMEROBOT版权所有侵权必究 | B+
Top Silkscreen Layer: D12 | D10 | D8 | D6 | D4 | D2 | GND | V G D8 | G LED+ | 燕归乐教育科技 | GAMEROBOT | SCK | MISO | MOSI | D11 | GPIO | 5V | D13 | A0 | A1 | A2 | D9 | A3 | SDA | A4 | D7 | SCL | A5 | A6 | D5 | A7 | D3 | D1 | TX | D0 | RX | B- | ON | 3V3

# Board 安装板
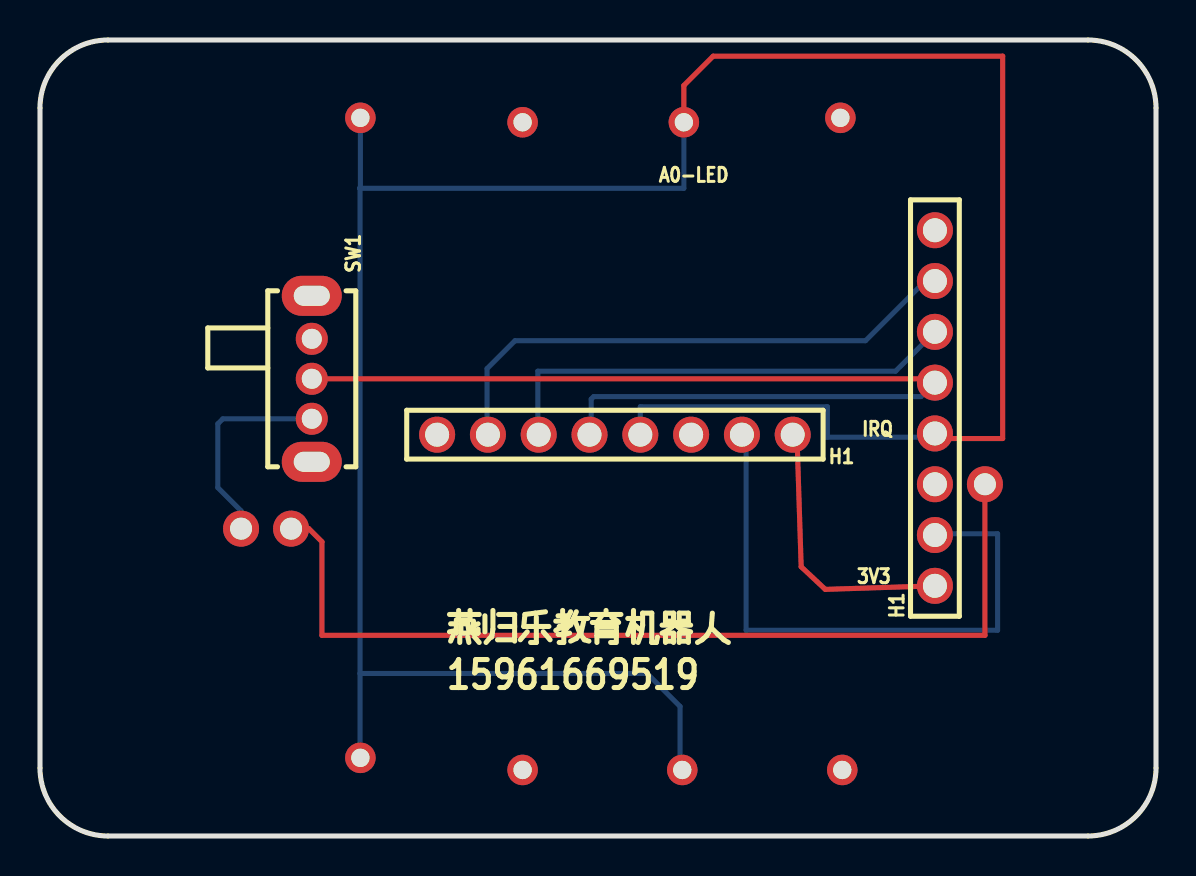
[diagram p6: board, top side]
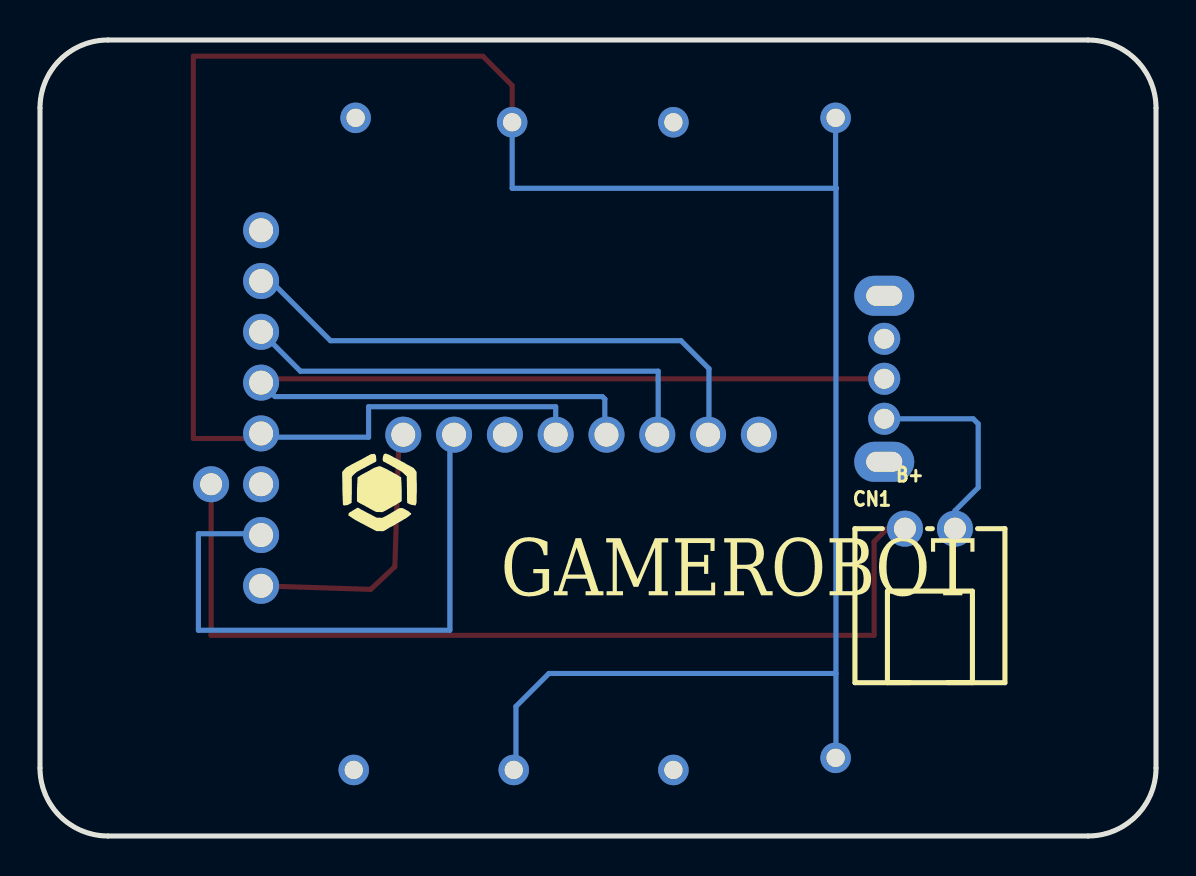
[diagram p7: board, bottom side, seen from below]

Outline 55.8 x 39.8 mm; copper layers: Top Layer, Bottom Layer. Coordinates in mm from the lower left corner of the outline.
Outline path: 0,36.4 0,3.4 arc(1,1) 3.4,0 52.4,0 arc(54.8,1) 55.8,3.4 55.8,36.4 arc(54.8,38.8) 52.4,39.8 3.4,39.8 arc(1,38.8) 0,36.4
Stack: Top Layer 0.035mm / Dielectric1 1.51mm FR4 er 4.5 / Bottom Layer 0.035mm

## Design rules (mm)
template: JLCPCB Capability(Two Layers Board)
spacing copperThickness1oz (default): track to track 0.102, other pairs 0.152 to 0.3
spacing copperThickness2oz: track to track 0.203, other pairs 0.152 to 0.3
track width copperThickness1oz (default): min 0.127, default 0.254, max 2.54
track width copperThickness2oz: min 0.203, default 0.254, max 2.54
differential pair differentialPair (default): width min 0.127, default 0.254, max 2.54; gap min 0.152, default 0.152
via viaSize (default): diameter min 0.5, default 0.61, max 10; hole min 0.3, default 0.305, max 6.3

## Placement (name value [footprint] x y rotation side)
CN1  HX25003-2WAP  [CONN-TH_2P-P2.50_HX25003-2WAP]  11.3 15.37 180 bottom
H1  -  [hdr-th_8p-p2.54-v-f-1]  28.75 20.07 180 top
H1#2  -  [hdr-th_8p-p2.54-v-f-1]  44.75 21.4 90 top
NOREF  -  [Pad_e2]  40.02 35.91 0 top
NOREF#2  -  [Pad_e28]  16.02 3.91 0 top
NOREF#3  -  [Pad_e17]  40.11 3.3 0 top
NOREF#4  -  [Pad_e33]  32.11 3.3 0 top
NOREF#5  -  [Pad_e26]  32.19 35.69 0 top
NOREF#6  -  [Pad_e27]  24.13 3.3 0 top
NOREF#7  -  [Pad_e133]  47.25 17.59 180 top
NOREF#8  -  [Pad_e4]  16.02 35.91 0 top
NOREF#9  -  [Pad_e25]  24.13 35.69 0 top
SW1  -  [拨动开关_侧]  13.59 22.86 270 top

## Footprints (pads in the part's own frame, mm; a bottom-side part is the same pattern mirrored in y, then rotated)
CONN-TH_2P-P2.50_HX25003-2WAP
  round 1.8 hole 1.1: 1(-1.25,0) 2(1.25,0)
hdr-th_8p-p2.54-v-f-1
  round 1.8 hole 1.2: 1(-8.89,0) 2(-6.35,0) 3(-3.81,0) 4(-1.27,0) 5(1.27,0) 6(3.81,0) 7(6.35,0) 8(8.89,0)
Pad_e2
  round 1.524 hole 0.914: 1(0,0)
Pad_e4
  round 1.524 hole 0.914: 2(0,0)
Pad_e17
  round 1.524 hole 0.914: 1(0,0)
Pad_e25
  round 1.524 hole 0.914: 1(0,0)
Pad_e26
  round 1.524 hole 0.914: 2(0,0)
Pad_e27
  round 1.524 hole 0.914: 3(0,0)
Pad_e28
  round 1.524 hole 0.914: 4(0,0)
Pad_e33
  round 1.524 hole 0.914: 4(0,0)
Pad_e133
  round 1.8 hole 1.1: 1(0,0)
拨动开关_侧
  oval 1.6x1.6 hole 1.001: 1(-1.999,0) 2(0,0) 3(1.999,0)
  oval 1.999x2.999 hole 1.001x1.801: 4(4.151,0) 5(-4.151,0)

## Nets
3V3: H1.1 H1#2.1
GND: H1.3 H1#2.3 NOREF.1 NOREF#3.1 NOREF#6.3 NOREF#9.1
B+: CN1.1 NOREF#7.1
GGG: CN1.2 SW1.3
IRQ: H1.4 H1#2.4 NOREF#2.4 NOREF#4.4 NOREF#5.2 NOREF#8.2
RST: H1.2 H1#2.2
SCK: H1.7 H1#2.7
SDA: H1.8 H1#2.8
SI: H1.6 H1#2.6
SO: H1.5 H1#2.5 SW1.2

Pads without a net: SW1 1 4 5

## Routing (per net, layer and track width the routed paths; a pad name or vN(x,y) marks a point on that pad's centre or on a via; arc(x,y) is an arc through that point)
3V3: length 13.7
  Top Layer w0.254: 37.85,20.07 38.06,13.46 39.27,12.33 H1#2.1
B+: length 47.2
  Top Layer w0.254: NOREF#7.1 47.25,10.03 14.1,10.03 14.1,14.71 13.44,15.37 CN1.1
GGG: length 10.5
  Bottom Layer w0.254: 13.59,20.86 9.14,20.86 8.89,20.61 8.89,17.42 10.05,16.26 CN1.2
IRQ: length 130.1
  Top Layer w0.254: 44.75,19.87 48.13,19.87 48.13,38.99 33.65,38.99 32.19,37.53 NOREF#5.2
  Bottom Layer w0.254: 15.98,32.38 16,32.37 16,8.13 ; 15.98,32.38 16.02,32.42 NOREF#8.2 ; 15.98,32.38 32.19,32.38 NOREF#5.2 ; 16,8.13 30.35,8.13 32,6.48 32,3.41 NOREF#4.4 ; 16,8.13 16,3.92 NOREF#2.4 ; H1#2.4 44.56,19.94 39.37,19.94 39.37,21.46 30.02,21.46 H1.4
RST: length 30.3
  Bottom Layer w0.254: H1#2.2 44.81,15.11 47.88,15.11 47.88,10.29 35.31,10.29 35.31,20.07
SCK: length 27.5
  Bottom Layer w0.254: H1#2.7 44.26,27.75 41.27,24.77 23.75,24.77 22.35,23.37 22.35,20.11 H1.7
SI: length 23.9
  Bottom Layer w0.254: H1.6 24.89,20.11 24.89,23.24 42.78,23.24 H1#2.6
SO: length 50.6
  Top Layer w0.254: H1#2.5 44.55,22.86 SW1.2
  Bottom Layer w0.254: H1#2.5 44.05,21.97 27.69,21.97 27.56,21.84 27.56,20.15 H1.5

## Text on the board
Bottom Silkscreen Layer: B+ | GAMEROBOT
Top Silkscreen Layer: A0-LED | 3V3 | IRQ | 燕归乐教育机器人 / 15961669519
